# Altium schematic sheet 02-ESP32.SchDoc
size A4; DocumentNumber: 2; SheetNumber: 2; SheetTotal: 8
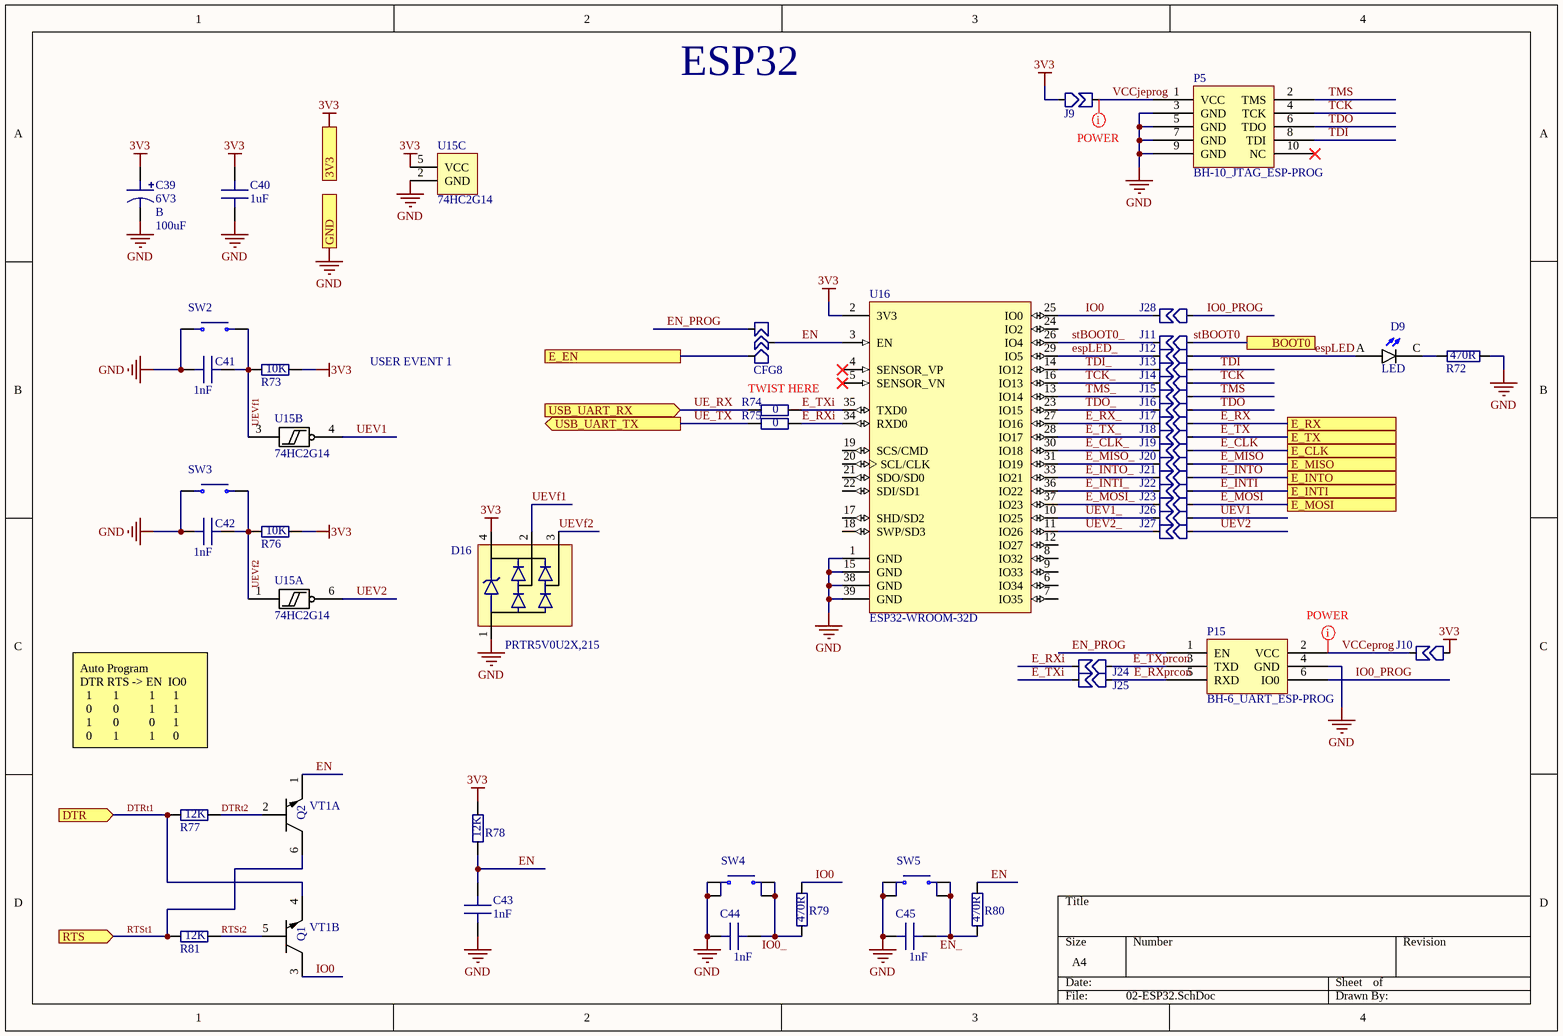
[diagram p0: 02-ESP32.SchDoc]

## Parts
C39  Voltage: 6V3  Size: B  [CAP_SIZE_B]  (hidden comment: 100uF)
C40  1uF  [C0805]
C41  1nF  [C0603]
C42  1nF  [C0603]
C43  1nF  [C0603]
C44  1nF  [C0603]
C45  1nF  [C0603]
CFG8  CFG3_ORTH  [CFG_0603]  (value not drawn)  (no BOM)
D9  LED  [LED_0604]
D16  PRTR5V0U2X,215  [SOT143B]
J9  CFG2  [CFG_J_0603]  (value not drawn)  (no BOM)
J10  CFG2  [CFG_J_0603]  (value not drawn)  (no BOM)
J11  CFG2  [CFG_J_0603]  (value not drawn)  (no BOM)
J12  CFG2  [CFG_J_0603]  (value not drawn)  (no BOM)
J13  CFG2  [CFG_J_0603]  (value not drawn)  (no BOM)
J14  CFG2  [CFG_J_0603]  (value not drawn)  (no BOM)
J15  CFG2  [CFG_J_0603]  (value not drawn)  (no BOM)
J16  CFG2  [CFG_J_0603]  (value not drawn)  (no BOM)
J17  CFG2  [CFG_J_0603]  (value not drawn)  (no BOM)
J18  CFG2  [CFG_J_0603]  (value not drawn)  (no BOM)
J19  CFG2  [CFG_J_0603]  (value not drawn)  (no BOM)
J20  CFG2  [CFG_J_0603]  (value not drawn)  (no BOM)
J21  CFG2  [CFG_J_0603]  (value not drawn)  (no BOM)
J22  CFG2  [CFG_J_0603]  (value not drawn)  (no BOM)
J23  CFG2  [CFG_J_0603]  (value not drawn)  (no BOM)
J24  CFG2  [CFG_J_0603]  (value not drawn)  (no BOM)
J25  CFG2  [CFG_J_0603]  (value not drawn)  (no BOM)
J26  CFG2  [CFG_J_0603]  (value not drawn)  (no BOM)
J27  CFG2  [CFG_J_0603]  (value not drawn)  (no BOM)
J28  CFG2  [CFG_J_0603]  (value not drawn)  (no BOM)
P5  BH-10_JTAG_ESP-PROG  [BH-10-SMD-1.27]
P15  BH-6_UART_ESP-PROG  [BH-6-SMD-1.27]
R72  Resistance: 470R  [R0603]
R73  Resistance: 10K  [R0603]
R74  Resistance: 0  [R0402]
R75  Resistance: 0  [R0402]
R76  Resistance: 10K  [R0603]
R77  Resistance: 12K  [R0603]
R78  Resistance: 12K  [R0603]
R79  Resistance: 470R  [R0603]
R80  Resistance: 470R  [R0603]
R81  Resistance: 12K  [R0603]
SW2  SWITCH_GEN_2P  [SW_TACTM-35N-F]  (value not drawn)
SW3  SWITCH_GEN_2P  [SW_TACTM-35N-F]  (value not drawn)
SW4  SWITCH_GEN_4P  [SW_4x4x1.5]  (value not drawn)
SW5  SWITCH_GEN_4P  [SW_4x4x1.5]  (value not drawn)
U15  74HC2G14  [SOT363/SOT65P210X110-6N]  (parts A,B,C of 3)
U16  ESP32-WROOM-32D  [ESP32-WROOM-32]
VT1  BC847BDW1T1G  [SOT363/SOT65P210X110-6N]  (value not drawn)  (parts A,B of 2)

## Ports
3V3, BOOT0, DTR (in), E_CLK, E_EN, E_INTI, E_INTO, E_MISO, E_MOSI, E_RX, E_TX, GND, RTS (in), USB_UART_RX (in), USB_UART_TX (out)

## Nets
3V3: C39.1 C40.2 D16.4(P$4) J9.2(IN) J10.2(IN) R73.2 R76.2 R78.2 U15.5(VCC) U16.2(3V3) ; port 3V3
GND: C39.2 C40.1 C41.2 C42.2 C43.1 C44.1 C45.1 D16.1(P$1) P5.3(GND) P5.5(GND) P5.7(GND) P5.9(GND) P15.4(GND) R72.2 SW2.1 SW3.1 SW4.1 SW4.3 SW5.1 SW5.3 U15.2(GND) U16.1(GND) U16.15(GND) U16.38(GND) U16.39(GND) ; port GND
DTRt1: R77.1 VT1.4 ; port DTR
DTRt2: R77.2 VT1.2
E_CLK: J19.2(IN) ; port E_CLK
E_CLK_: J19.1(A) U16.30(IO18)
E_EN: CFG8.3(B) ; port E_EN
E_INTI: J22.2(IN) ; port E_INTI
E_INTI_: J22.1(A) U16.36(IO22)
E_INTO: J21.2(IN) ; port E_INTO
E_INTO_: J21.1(A) U16.33(IO21)
E_MISO: J20.2(IN) ; port E_MISO
E_MISO_: J20.1(A) U16.31(IO19)
E_MOSI: J23.2(IN) ; port E_MOSI
E_MOSI_: J23.1(A) U16.37(IO23)
E_RX: J17.2(IN) ; port E_RX
E_RX_: J17.1(A) U16.27(IO16)
E_RXi: J24.1(A) R75.2 U16.34(RXD0)
E_RXprcon: J25.2(IN) P15.5(RXD)
E_TX: J18.2(IN) ; port E_TX
E_TX_: J18.1(A) U16.28(IO17)
E_TXi: J25.1(A) R74.2 U16.35(TXD0)
E_TXprcon: J24.2(IN) P15.3(TXD)
EN: C43.2 CFG8.2(IN) R78.1 R80.2 U16.3(EN) VT1.1
EN_: C45.2 R80.1 SW5.2 SW5.4
EN_PROG: CFG8.1(A) P15.1(EN)
espLED: D9.A J12.2(IN)
espLED_: J12.1(A) U16.29(IO5)
IO0: J28.1(A) R79.2 U16.25(IO0) VT1.3
IO0_: C44.2 R79.1 SW4.2 SW4.4
IO0_PROG: J28.2(IN) P15.6(IO0)
RTSt1: R81.1 VT1.6 ; port RTS
RTSt2: R81.2 VT1.5
stBOOT0: J11.2(IN) ; port BOOT0
stBOOT0_: J11.1(A) U16.26(IO4)
TCK: J14.2(IN) P5.4(TCK)
TCK_: J14.1(A) U16.16(IO13)
TDI: J13.2(IN) P5.8(TDI)
TDI_: J13.1(A) U16.14(IO12)
TDO: J16.2(IN) P5.6(TDO)
TDO_: J16.1(A) U16.23(IO15)
TMS: J15.2(IN) P5.2(TMS)
TMS_: J15.1(A) U16.13(IO14)
UE_RX: R74.1 ; port USB_UART_RX
UE_TX: R75.1 ; port USB_UART_TX
UEV1: J26.2(IN) U15.4(2Y)
UEV1_: J26.1(A) U16.10(IO25)
UEV2: J27.2(IN) U15.6(1Y)
UEV2_: J27.1(A) U16.11(IO26)
UEVf1: C41.1 D16.2(P$2) R73.1 SW2.2 U15.3(2A)
UEVf2: C42.1 D16.3(P$3) R76.1 SW3.2 U15.1(1A)
VCCeprog: J10.1(A) P15.2(VCC)
VCCjeprog: J9.1(A) P5.1(VCC)
NetD9_C: D9.C R72.1

Not connected (* = marked no-connect by the designer): P5 10(NC)*; U16 4(SENSOR_VP)* 5(SENSOR_VN)* 6(IO34) 7(IO35) 8(IO32) 9(IO33) 12(IO27) 17(SHD/SD2) 18(SWP/SD3) 19(SCS/CMD) 20(SCL/CLK) 21(SDO/SD0) 22(SDI/SD1) 24(IO2)

## Layout directives
net class POWER_NET_CLASS: VCCeprog, VCCjeprog

## Notes on the sheet
- ESP32
- USER EVENT 1
- (near R74) TWIST HERE
- Auto Program
  DTR RTS -> EN  IO0
  1       1          1      1
  0       0          1      1
  1       0          0      1
  0       1          1      0
- (in symbol BC847BDW1T1G, part A) Q2
- (in symbol BC847BDW1T1G, part B) Q1

## Library data of the parts
C39 = CAP_B_100uF_6V3: Tantalum capacitor; Capacity: 100uF; Value: 100uF; PriceRCSUAH: 5,5; RCS: https://www.rcscomponents.kiev.ua/product/100uf-6-3v-size-b-10-tajb107k006rnj-avx-kondensator-tantalovyj-smd_39633.html
C40 = C0805_1uF_25V: Ceramic capacitor; Voltage: 25V; Capacity: 1uF; Size: 0805; Value: 1uF; PriceKosmodromUAH: 1; Kosmodrom: http://www.kosmodrom.com.ua/el.php?name=CP0805125V10
C41-C45 = C0603_1nF_25V: Ceramic capacitor; Voltage: 25V; Capacity: 1nF; Size: 0603; Value: 1nF; PriceKosmodromUAH: 0,75; Kosmodrom: http://www.kosmodrom.com.ua/el.php?name=CP0603100050V10
D9 = LED: Led General; MF: Dialight; MP: 598-8140-107F; Owned: 3000; SnapEDA_Link: https://www.snapeda.com/parts/598-8140-107F/Dialight/view-part/?ref=snap; Price: None; Availability: Unavailable; Package: 0805 Dialight; Value: *
D16 = PRTR5V0U2X,215: PRTR5V0U2X - Ultra low capacitance double rail-to-rail ESD protection diode; MF: Nexperia USA; Owned: 10; Package: SOT-143 Nexperia; Price: None; Availability: Unavailable; MP: PRTR5V0U2X,215; SnapEDA_Link: https://www.snapeda.com/parts/PRTR5V0U2X%2C215/Nexperia%20USA%20Inc./view-part/?ref=snap; Value: *; PriceKosmodromUAH: 3,25; Kosmodrom: http://www.kosmodrom.com.ua/el.php?name=PRTR5V0U2X.215
P5 = BH-10_JTAG_ESP-PROG: 1,27 mm 2x5 Header; Owned: 10; PriceKosmodromUAH: 7; Kosmodrom: http://www.kosmodrom.com.ua/el.php?name=BH1.27SMD-10
P15 = BH-6_UART_ESP-PROG: 1,27 mm 2x3 Header; Owned: 20; PriceAliexpress: 7; Aliexpress: https://www.aliexpress.com/item/4000400690967.html?spm=a2g0s.9042311.0.0.cbd34c4duRVTSV
R72 R79 R80 = R0603_470R: Resistor General; Tolerance: 5%; Owned: 3000; Size: 0603
R73 R76 = R0603_10K: Resistor General; Tolerance: 5%; Owned: 3000; Size: 0603; PriceRCSUAH: 0,06; RCS: https://www.rcscomponents.kiev.ua/product/10-kohm-5-0-1w-50v-0603-rc0603jr-0710kl-yageo_107096.html
R74 R75 = R0402_0R: Resistor General; Tolerance: *; Size: 0402; PriceKosmodromUAH: 0,04; PriceRCSUAH: 0,05; Kosmodrom: http://www.kosmodrom.com.ua/el.php?name=0402SMDRES0OM5; RCS: https://www.rcscomponents.kiev.ua/product/0-ohm-0402-wr04x000ptl-walsin_105536.html
R77 R78 R81 = R0603_12K: Resistor General; Tolerance: 5%; Owned: 3000; Size: 0603; PriceRCSUAH: 0,06; RCS: https://www.rcscomponents.kiev.ua/product/12-kohm-5-0-1w-50v-0603-rc0603jr-12k0-hitano-rezistor-smd_1014.html
SW2 SW3 = SWITCH_GEN_2P: SWITCH DIP 4.3 mm; PriceKosmodromUAH: 1,25; Kosmodrom: http://www.kosmodrom.com.ua/el.php?name=TACT-35N-F
SW4 SW5 = SWITCH_GEN_4P: SWITCH DIP 4.3 mm; PriceKosmodromUAH: 0,5; Kosmodrom: http://www.kosmodrom.com.ua/el.php?name=TACT-5X5X1.5
U15 = 74HC2G14: Dual inverting Schmitt trigger; PriceKosmodromUAH: 4,5; Kosmodrom: http://www.kosmodrom.com.ua/el.php?name=74HC2G14GW.125
U16 = ESP32-WROOM-32D: / IC: SoC; GPIO, I2C, I2S, IR, SD, SDIO, SPI, UART; 2.7Г·3.6VDC; 20dBm /; MF: Espressif Systems; Owned: 2; MP: ESP32-WROOM-32D; Package: Module Espressif Systems; Availability: Unavailable; Price: None; SnapEDA_Link: https://www.snapeda.com/parts/ESP32-WROOM-32D/Espressif%20Systems/view-part/?ref=snap; Value: *; PriceUAH: 135; PriceAliexpress: 2,5; OtherUA: https://www.olx.ua/uk/obyavlenie/esp-wroom-32-esp-32-module-IDGzoQv.html; Aliexpress: https://www.aliexpress.com/item/32963147246.html
VT1 = BC847BDW1T1G: Dual General Purpose Transistors NPN SOT 363; PriceKosmodromUAH: 1,5; Kosmodrom: http://www.kosmodrom.com.ua/el.php?name=BC847BDW1T1G